# Altium schematic sheet usb_hub.SchDoc
size A4; SheetNumber: 4; SheetTotal: 5
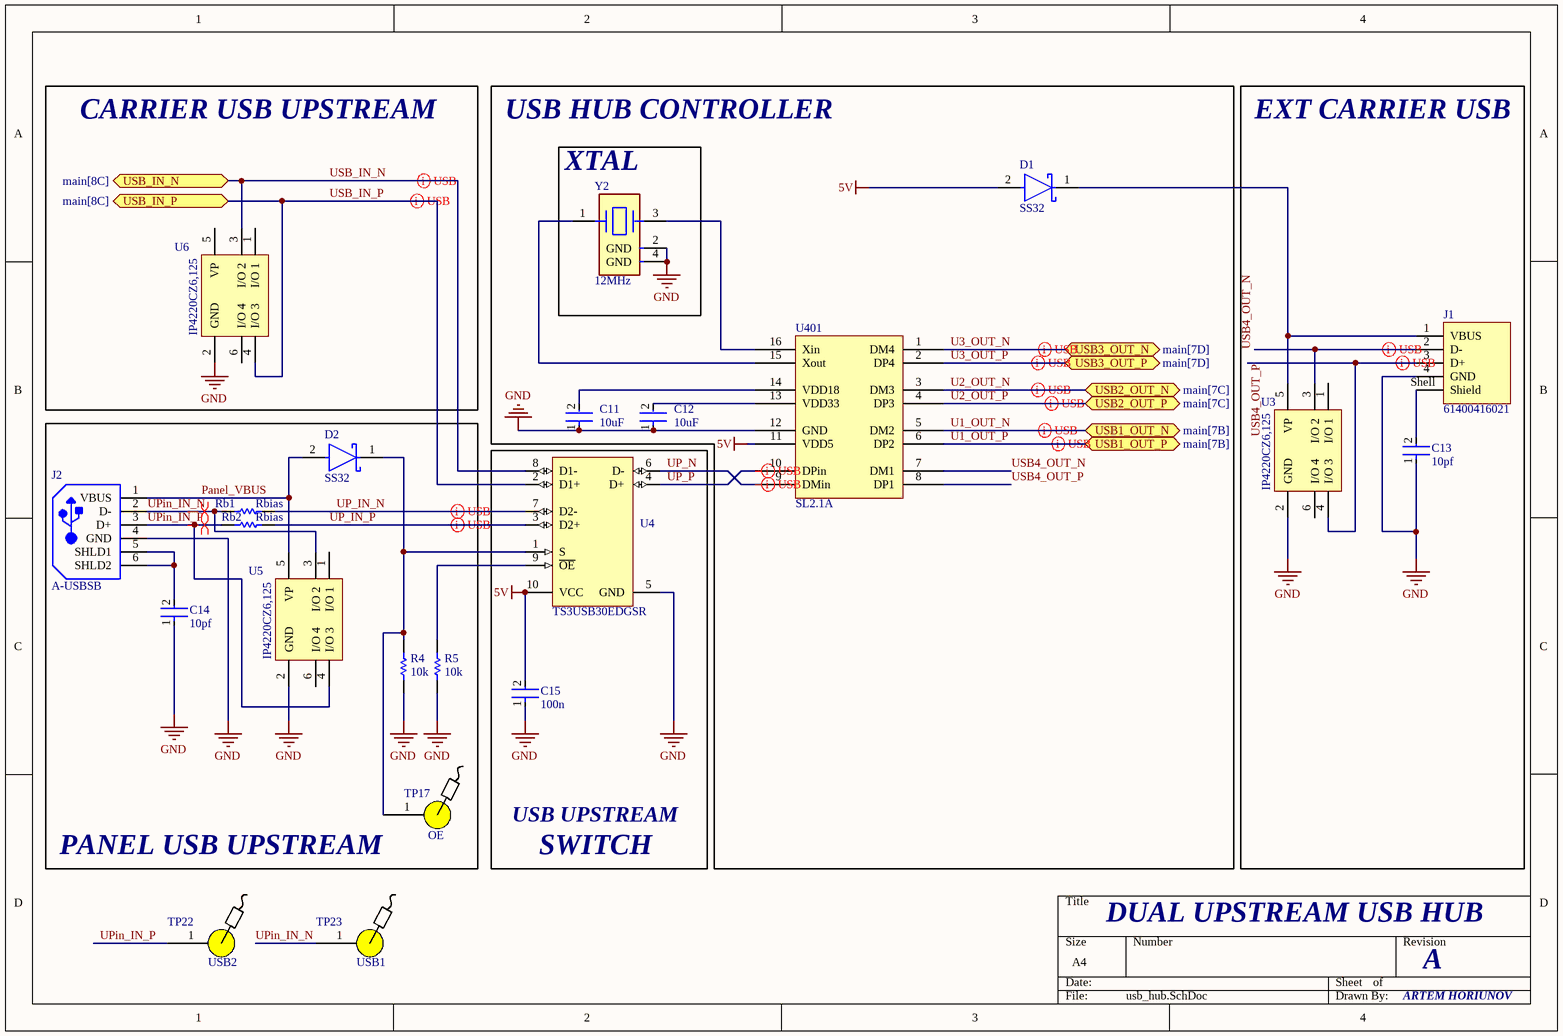
[diagram p0: usb_hub.SchDoc]

## Parts
C11  10uF  [FP-C0603C-CF-MFG]
C12  10uF  [FP-C0603C-CF-MFG]
C13  10pf  [FP-C0603C-CF-MFG]
C14  10pf  [FP-C0603C-CF-MFG]
C15  100n  [FP-C0603C-CF-MFG]
D1  SS32  [FP-403AG-MFG]
D2  SS32  [FP-403AG-MFG]
J1  61400416021  [61400416021]
J2  A-USBSB  [ASSM-A-USBSB-4_V]
R4  10k  [RESC0603(1608)_N]
R5  10k  [RESC0603(1608)_N]
Rb1  Rbias  [RESC1005X40X25NL05T05]
Rb2  Rbias  [RESC1005X40X25NL05T05]
TP17  OE  [TestPoint]
TP22  USB2  [TestPoint]
TP23  USB1  [TestPoint]
U3  IP4220CZ6,125  [NXP-SOT457_L]
U4  TS3USB30EDGSR  [DGS0010A_N]
U5  IP4220CZ6,125  [NXP-SOT457_L]
U6  IP4220CZ6,125  [NXP-SOT457_L]
U401  SL2.1A  [SOIC127P600X160-16N]
Y2  12MHz  [FP-7M-MFG]

## Blocks framed on the sheet
CARRIER USB UPSTREAM: U6
USB HUB CONTROLLER: C11 C12 D1 U401
EXT CARRIER USB: C13 J1 U3
XTAL: Y2
PANEL USB UPSTREAM: C14 D2 J2 R4 R5 Rb1 Rb2 TP17 U5
SWITCH: C15 U4

## Ports
USB1_OUT_N (bidir, see main[7B]), USB1_OUT_P (bidir, see main[7B]), USB2_OUT_N (bidir, see main[7C]), USB2_OUT_P (bidir, see main[7C]), USB3_OUT_N (bidir, see main[7D]), USB3_OUT_P (bidir, see main[7D]), USB_IN_N (bidir, see main[8C]), USB_IN_P (bidir, see main[8C])

## Nets
5V: C15.2 D1.2(A) U4.10(VCC) U401.11(VDD5)
GND: C11.1 C12.1 C13.1 C14.1 C15.1 J1.4(GND) J2.4(GND) R4.1 R5.1 U3.2(GND) U4.5(GND) U5.2(GND) U6.2(GND) U401.12(GND) Y2.2(GND) Y2.4(GND)
Panel_VBUS: D2.2(A) J2.1(VBUS) U5.5(VP)
U1_OUT_N: U401.5(DM2) ; port USB1_OUT_N
U1_OUT_P: U401.6(DP2) ; port USB1_OUT_P
U2_OUT_N: U401.3(DM3) ; port USB2_OUT_N
U2_OUT_P: U401.4(DP3) ; port USB2_OUT_P
U3_OUT_N: U401.1(DM4) ; port USB3_OUT_N
U3_OUT_P: U401.2(DP4) ; port USB3_OUT_P
UP_IN_N: Rb1.2 U4.7(D2-)
UP_IN_P: Rb2.2 U4.3(D2+)
UP_N: U4.6(D-) U401.9(DMin)
UP_P: U4.4(D+) U401.10(DPin)
UPin_IN_N: J2.2(D-) Rb1.1 TP23.1 U5.3(I/O_2)
UPin_IN_P: J2.3(D+) Rb2.1 TP22.1 U5.4(I/O_3)
USB4_OUT_N: J1.2(D-) U3.3(I/O_2) U401.7(DM1)
USB4_OUT_P: J1.3(D+) U3.4(I/O_3) U401.8(DP1)
USB_IN_N: U4.8(D1-) U6.3(I/O_2) ; port USB_IN_N
USB_IN_P: U4.2(D1+) U6.4(I/O_3) ; port USB_IN_P
NetC11_2: C11.2 U401.14(VDD18)
NetC12_2: C12.2 U401.13(VDD33)
NetC13_2: C13.2 J1.Shell(Shield)
NetC14_2: C14.2 J2.5(SHLD1) J2.6(SHLD2)
NetD1_1: D1.1(C) J1.1(VBUS) U3.5(VP)
NetD2_1: D2.1(C) R4.2 TP17.1 U4.1(S)
NetR5_2: R5.2 U4.9(~{OE})
NetU401_15: U401.15(Xout) Y2.1
NetU401_16: U401.16(Xin) Y2.3

Not connected (* = marked no-connect by the designer): U3 1(I/O_1) 6(I/O_4); U5 1(I/O_1) 6(I/O_4); U6 1(I/O_1) 5(VP) 6(I/O_4)

## Layout directives
differential pair; differential pair class USB: U1_OUT_N, U1_OUT_P, U2_OUT_N, U2_OUT_P, U3_OUT_N, U3_OUT_P, UP_IN_N, UP_IN_P, UP_N, UP_P, USB4_OUT_N, USB4_OUT_P, USB_IN_N, USB_IN_P
differential pair: UPin_IN_N, UPin_IN_P

## Notes on the sheet
- USB UPSTREAM
- DUAL UPSTREAM USB HUB
- A
- ARTEM HORIUNOV

## Library data of the parts
C11-C15 = CMP-2006-03061-2: CAP CER 0.1UF 50V X7R 0603; Manufacturer: KEMET; Manufacturer Part Number: C0603C104K5RACTU; Tolerance: 0.1; Temperature Coefficient: 30ppm/°C; Material: Ceramic; Automotive Grade: Grade 1; Value: 0.10 μF; Temperature: -55°C to +125°C; RoHS: TRUE; Temperature Range High: +125°C; Lead Free: Yes; Octopart: https://octopart.com/c0603c104k5ractu-kemet-139244; Digikey Description: CAP CER 0.1UF 50V X7R 0603; Category: Cap; Package: C0603C-CF; ComponentLink2Description: Datasheet; Temperature Range Low: -55°C; Device Class L1: Passive Components; Voltage Rating: 50 V; Automotive: Yes; Device Class L3: Ceramic Capacitors; ComponentLink2URL: https://api.kemet.com/component-edge/download/datasheet/C0603C100J5GACAUTO.pdf; Capacitance: 0.10 μF; Device Class L2: Capacitors; Temperature Characteristic: X7R; Height: 0.87mm
D1 D2 = CMP-00278-84331622-1: SS32 Rectifier Diode, Schottky, 1 Phase, 1 Element, 3A, 20V V(RRM), Silicon, DO-214AB; Manufacturer Lifecycle Status: ACTIVE; Forward Voltage: 500mV; Max Forward Surge Current (Ifsm): 100A; Max Reverse Leakage Current: 500µA; Max Junction Temperature (Tj): 150°C; Element Configuration: Single; Max Power Dissipation: 2.27W; Polarity: Standard; Number of Elements: 1; RoHS: Compliant; Forward Current: 3A; Height: 2.65mm; Max Reverse Voltage (DC): 20V; NexarPartId: 84331622; Max Repetitive Reverse Voltage (Vrrm): 20V; Schedule B: 8541100080, 8541100080; Lead Free: Lead Free; Current Rating: 3A; Radiation Hardening: No; Mount: Surface Mount; Max Operating Temperature: 150°C; Average Rectified Current: 3A; Number of Pins: 2; Output Current: 3A; Packaging: Cut Tape; Min Operating Temperature: -55°C; Max Surge Current: 100A; REACH SVHC: No SVHC; Case/Package: SMC; Weight: 300mg; Lifecycle Status: Production; Peak Reverse Current: 500µA; Number of Terminals: 2; Width: 6.25mm; Length: 7.15mm; Voltage Rating (DC): 20V; Peak Non-Repetitive Surge Current: 100A
J1 = CMP-1502-03227-2: NexarPartId: 21041530; Contact Resistance: 20mΩ; Gender: Receptacle; Voltage Rating (DC): 30V; Current Rating: 1.5A; Connector Type: USB; Insulation Resistance: 1GΩ; USB Standard: USB 2.0; Number of Contacts: 4; Number of Ports: 1; Width: 14.4mm; REACH SVHC: Unknown; Contact Plating: Gold; Length: 15.8mm; Lead Free: Lead Free; Max Operating Temperature: 105°C; Orientation: Horizontal; Contact Material: Copper; Voltage Rating: 30V; Min Operating Temperature: -40°C; Flammability Rating: UL94 V-0; Color: White; RoHS: Compliant; Number of Pins: 4; Mount: Horizontal, Through Hole; Number of Positions: 4; Operating Supply Voltage: 30V; Insulation Material: PBT; Termination: Solder
J2 = CMP-2000-05874-1: Connector Receptacle, USB Type B, Right Angle, -20 to 85 degC, 4-Pin THD, RoHS, Tray; Manufacturer: ASSMANN WSW; Gender: Female; CAD Drawing: 3DCADModel; Number of Ports: 1; Mounting Type: ThroughHole; Datasheet URL: https://datasheet.ciiva.com/11731/0900766b80da421f-11731321.pdf; Datasheet Version: 12/2009; Manufacturer URL: http://www.assmann.us/; Package Description: 4-Pin Through Hole Device, Body 16.5 x 12.04 mm; Body Orientation: RightAngle; Mounting Technology: ThroughHole; Package Reference: USBSB; Termination Method: Solder
R4 R5 = CMP-1012-00081-1: 0.1W 1% 0603 (1608 Metric)  SMD; Tolerance: 5 %; Case-Metric: 1608; Value: 2000.00 Ohm; Case-EIA: 0603; Technology: SMT; Power: 0.1 W
Rb1 Rb2 = CMP-2002-08143-1: Part Number: CRCW040210R0FKED; Manufacturer: Vishay Dale
TP17 TP22 TP23 = TestPoint
U3 U5 U6 = CMP-2000-06457-1: Dual USB 2.0 integrated ESD protection, 0 to 5.5 V, -40 to 85 degC, 6-Pin TSOP (SOT457), RoHS, Tape and Reel; Manufacturer: NXP Semiconductors; Product Height (mm): 1mm; Rad Hardened: No; Package Version: 06-03-16, 03/2006; Product Length (mm): 3.1mm; VIN Max: 5.5V; Configuration: Quad; Suppressor Type: DiodeArrays; Number of Channels: 4; VF: 0.7V; Capacitance Value: 1.2pF; Product Depth (mm): 1.7mm; VIN Min: 0V; Leakage Current (Max): 0.1uA; ESD Protection Voltage: 8KV@ContactDisc; Direction Type: Uni-Directional; Manufacturer URL: http://www.nxp.com/; Package Reference: SOT457; Datasheet URL: http://cache.nxp.com/documents/data_sheet/IP4220CZ6.pdf; Operating Temperature Max Deg. C: 85C; Packaging: TapeandReel; Package Description: 6-Pin Thin Small Outline Package, Body 2.9 x 1.5 mm, Pitch 0.95 mm; PartNumber: IP4220CZ6; Mounting Technology: SurfaceMount; Working Voltage (Max): 5.5V; Operating Temperature Min Deg. C: -40C; Working Voltage: 5.5V; Package / Case: TSOP; Package URL: http://www.nxp.com/documents/outline_drawing/sot457_po.pdf; Leakage Current: 0.1uA; Pin Count: 6; Mounting Style: SurfaceMount; Datasheet Version: Rev. 5, 07/2011
U4 = CMP-0309-00091-2: High-Speed USB 2.0 (480-Mbps) 1:2 Multiplexer / Demultiplexer Switch with Single, 10 ohm RON, 3.0 to 4.3V, -40 to 85 degC, 10-Pin MSOP (DGS), Green (RoHS & no Sb/Br); Manufacturer: Texas Instruments; Architecture: "1","2 mux/demux"; tpd max(ns): 0.25; ICC(uA): 1; IL OFF(Max)(nA): 2; OFF Time(Max)(ns): 30; SubFamily: USB Switch; ESD HBM(kV): +/-8; Bandwidth(MHz): 900; RON Mis-match(Max)(Ohms): 0.35; ON Time(Max)(ns): 25; ron(max)(ohms): 10; PartNumber: TS3USB30EDGSR; ComponentLink1URL: http://www.ti.com/general/docs/lit/getliterature.tsp?genericPartNumber=TS3USB30E&fileType=pdf; Vcc range(V): 3.0 to 4.3; PackageReference: DGS0010A; Code_JEDEC: MO-187-BA; PackageDescription: 10-Pin Thin Shrink Small Outline Package 0.5 mm Pitch; Eco-Plan: Green (RoHS & no Sb/Br); ComponentLink2URL: http://www.ti.com/litv/pdf/mpds035b; Number of Channels: 2; Mounting Technology: Surface Mount; PackageVersion: revC, Feb-2004; DatasheetVersion: SCDS255D; ComponentLink1Description: Datasheet; ComponentLink2Description: Package Specification; RON Flatness(Max)(Ohms): 2
Y2 = CMP-18717-000311-1: Crystal; ESR (Equivalent Series Resistance): 100R; Frequency Stability: 10ppm; Load Capacitance: 10pF; Width: 0.098inch; Number of Pins: 4; Case/Package: SMD/SMT; REACH SVHC: No SVHC; Frequency: 12MHz; Mount: Surface Mount; Max Operating Temperature: 70°C; RoHS Compliant: Yes; Depth: 2.5mm; Length: 3.2mm; Termination: SMD/SMT; Frequency Tolerance: 10ppm; Min Operating Temperature: -20°C; Series: 7M; Packaging: Tape and Reel; Tolerance: 10ppm; Height: 0.031inch; Package Quantity: 3000